# EAGLE design SOT-23-8-Adapter (EAGLE 7.3.0)
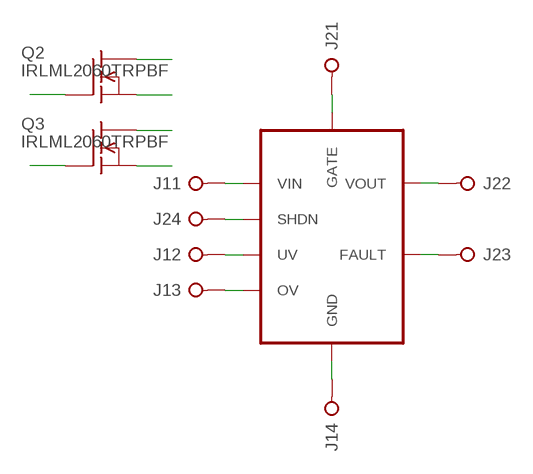
[diagram p0: schematic, sheet 1]

## Parts
J1  PINHD-1X4  [1X04]
J2  PINHD-1X4  [1X04]
Q1  LTC4365  [SOT-23-8]
Q2  IRLML2060TRPBF  [SOT-23-3]
Q3  IRLML2060TRPBF  [SOT-23-3]

## Nets
1-1: J1.1 Q1.1(VIN) Q2.2(SRC)
1-2: J1.2 Q1.2(UV) Q2.1(GATE)
1-3: J1.3 Q1.3(OV) Q3.2(SRC)
1-4: J1.4 Q1.4(GND) Q3.1(GATE)
2-1: J2.1 Q1.8(GATE) Q2.3(DRN)
2-2: J2.2 Q1.7(VOUT)
2-3: J2.3 Q1.6(FAULT)
2-4: J2.4 Q1.5(SHDN) Q3.3(DRN)

## Library data of the parts
J1 J2 = SaintGimp:PINHD-1X4
Q1 = SaintGimp:LTC4365: LTC4365 Overvoltage, Undervoltage and Reverse Supply Protection Controller
Q2 Q3 = SaintGimp:IRLML2060TRPBF: N-MOSFET 60V 1.2A 480mOhm

## Board
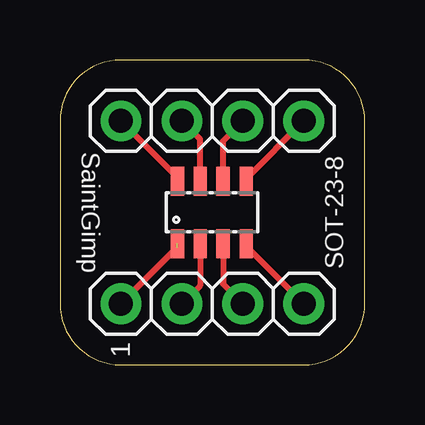
[diagram p1: board, top side]
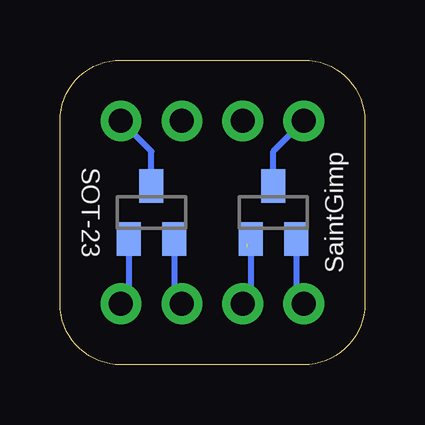
[diagram p2: board, bottom side, seen from below]

Size 12.7 x 12.7 mm. Coordinates in mm from the lower left corner, seen from the top.
Outline: 12.7,2.54 12.7,10.16 arc90 10.16,12.7 2.54,12.7 arc90 0,10.16 0,2.54 arc90 2.54,0 10.16,0 arc90 12.7,2.54
Copper layers (1*16): Top 0.0356mm / dielectric 1.5011mm / Bottom 0.0356mm
Design rules "Saintgimp-OSHPark": minimum track width 10mil, minimum drill 13mil, track to track 6mil, track to pad 6mil, pad to pad 6mil, via to via 6mil, smd to smd 6mil, copper to edge 15mil, drill to drill 6mil, minimum pad ring 7mil, minimum via ring 7mil, stop-mask expansion 3mil, vias tented up to drill 0mil, thermal gap 10mil

### Footprints (pad centres in the part's own frame; a part is rotated, then mirrored left to right if it is on the bottom)
1X04 = drill 1: 1 -3.81,0; 2 -1.27,0; 3 1.27,0; 4 3.81,0
SOT-23-8 = smd 0.55 x 1.2: 1 -1.458,-1.3; 2 -0.508,-1.3; 3 0.442,-1.3; 4 1.407,-1.3; 5 1.407,1.3; 6 0.442,1.3; 7 -0.508,1.3; 8 -1.458,1.3
SOT-23-3 = smd 1 x 1.4: 1 -0.95,-1.1; 2 0.95,-1.1; 3 0,1.1

### Placement (x,y rotation side)
J1  6.35,2.54 0 top
J2  6.35,10.16 0 top
Q1  6.35,6.35 0 top
Q2  3.81,6.35 0 bottom
Q3  8.89,6.35 0 bottom

### Tracks (layer width: path | path; a pad name or v marks a point on that pad's centre or on a via)
1-1  (1 unrouted)
  Top 0.254: 4.89,4.89 J1.1
  Bottom 0.254: Q2.2 2.86,2.86 J1.1
1-2
  Top 0.254: Q1.2 5.84,3.3 J1.2
  Bottom 0.254: Q2.1 4.76,2.86 J1.2
1-3
  Top 0.254: Q1.3 6.79,3.37 J1.3
  Bottom 0.254: Q3.2 7.94,2.86 J1.3
1-4
  Top 0.254: Q1.4 7.76,4.94 J1.4
  Bottom 0.254: Q3.1 9.84,2.86 J1.4
2-1
  Top 0.254: Q1.8 arc45 4.78,7.92 J2.1
  Bottom 0.254: Q2.3 3.81,8.89 J2.1
2-2
  Top 0.254: Q1.7 5.84,9.4 J2.2
2-3
  Top 0.254: Q1.6 6.79,9.33 J2.3
2-4
  Top 0.254: Q1.5 7.76,7.76 J2.4
  Bottom 0.254: Q3.3 8.89,8.89 J2.4

### Text on the board
_tsilk: SaintGimp | SOT-23-8 | 1
_bsilk: SaintGimp | SOT-23